# EAGLE schematic xmega-128a4u-switch (EAGLE 8.3.2)
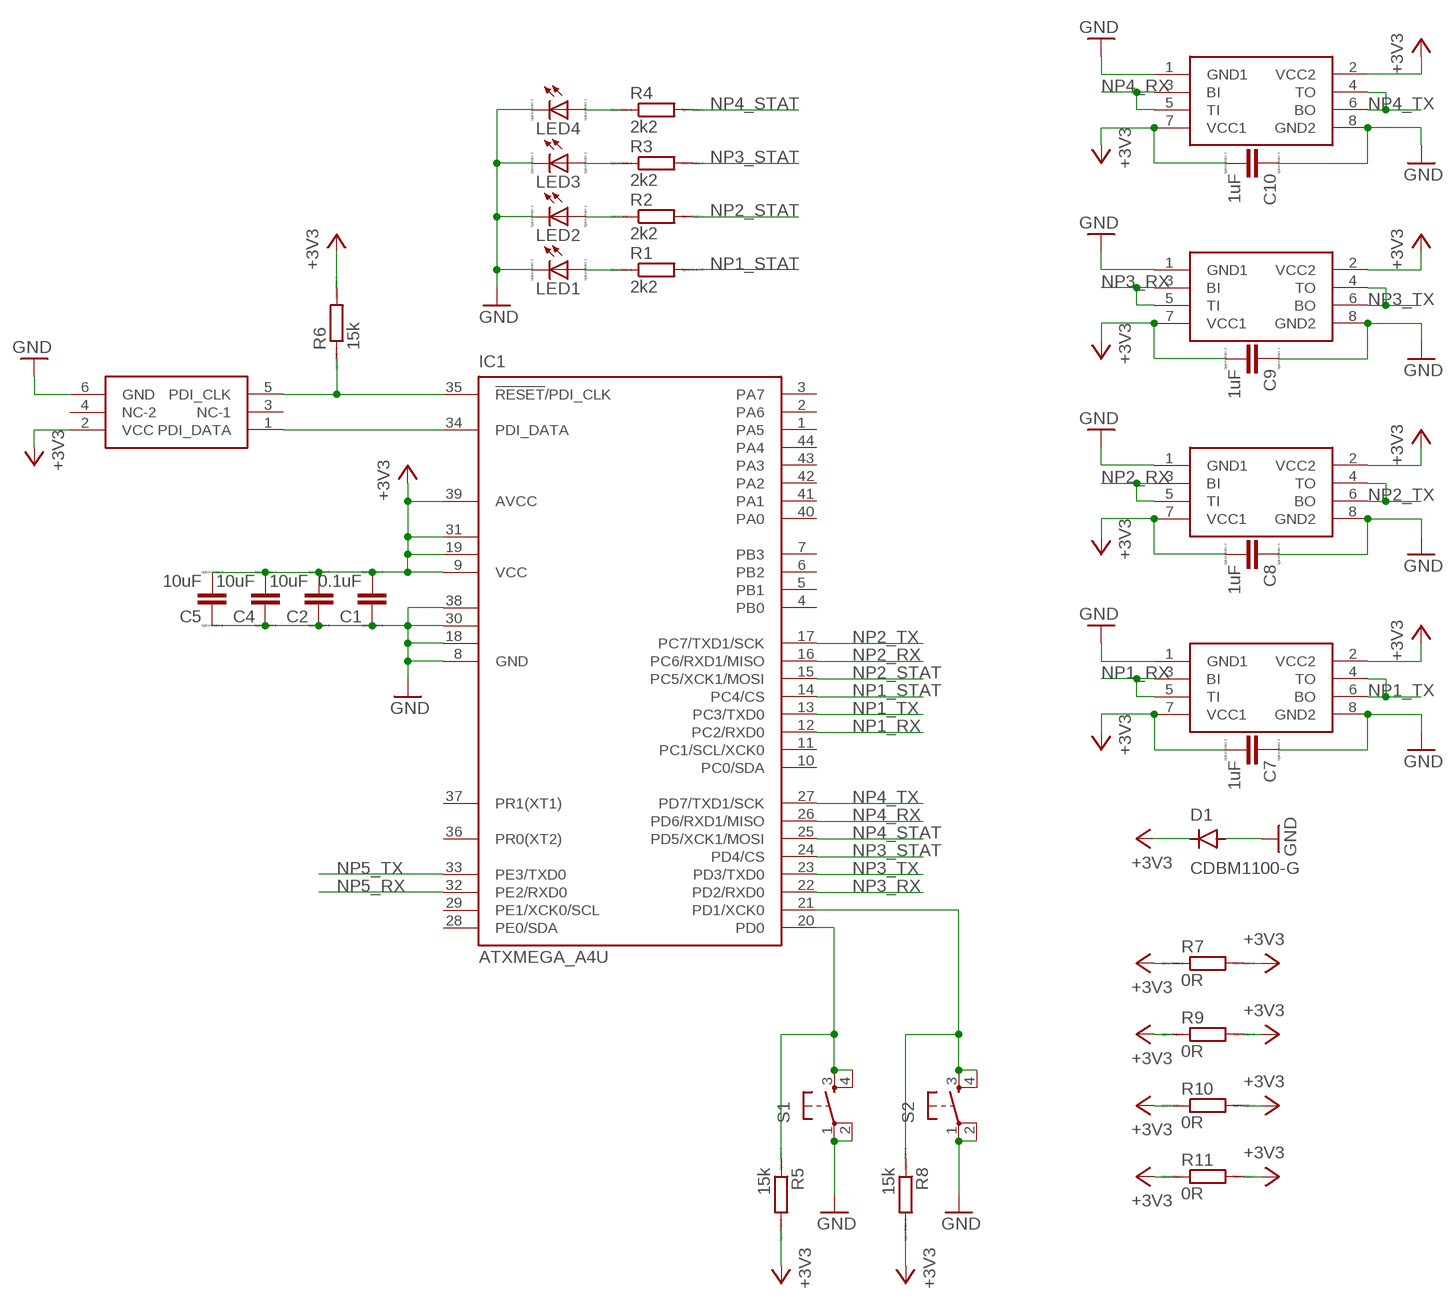
[diagram p0: schematic, sheet 1]

## Parts
C1  0.1uF  C  [C0805]
C2  10uF  CC1206  [C1206]
C4  10uF  CC1206  [C1206]
C5  10uF  CC1206  [C1206]
C7  1uF  C  [C0805]
C8  1uF  C  [C0805]
C9  1uF  C  [C0805]
C10  1uF  C  [C0805]
D1  CDBM1100-G  [MINI-SMA]
IC1  ATXMEGA_A4U  [TQFP44-13THIN]
LED1  LED_E  [LED_1206]
LED2  LED_E  [LED_1206]
LED3  LED_E  [LED_1206]
LED4  LED_E  [LED_1206]
R1  2k2  RR1206  [R1206]
R2  2k2  RR1206  [R1206]
R3  2k2  RR1206  [R1206]
R4  2k2  RR1206  [R1206]
R5  15k  R  [R0805]
R6  15k  R  [R0805]
R7  0R  RR1206  [R1206]
R8  15k  R  [R0805]
R9  0R  RR1206  [R1206]
R10  0R  RR1206  [R1206]
R11  0R  RR1206  [R1206]
S1  6MM_SWITCH6MM_SWITCH  [6MM_SWITCH]
S2  6MM_SWITCH6MM_SWITCH  [6MM_SWITCH]
U$3  NETPORT_IDC_FULLFLIP  [2X04SMD]
U$4  NETPORT_IDC_FULLFLIP  [2X04SMD]
U$5  NETPORT_IDC_FULLFLIP  [2X04SMD]
U$6  NETPORT_IDC_FULLFLIP  [2X04SMD]
U$7  PDI  [2X03SMD]

## Nets
+3V3: C1.2 C2.2 C4.2 C5.2 C7.2 C8.2 C9.2 C10.2 D1.KATHODE IC1.9(VCC) IC1.19(VCC1) IC1.31(VCC2) IC1.39(AVCC) R5.2 R6.2 R7.1 R7.2 R8.2 R9.1 R9.2 R10.1 R10.2 R11.1 R11.2 U$3.2(VCC2) U$3.7(VCC1) U$4.2(VCC2) U$4.7(VCC1) U$5.2(VCC2) U$5.7(VCC1) U$6.2(VCC2) U$6.7(VCC1) U$7.2(VCC)
GND: C1.1 C2.1 C4.1 C5.1 C7.1 C8.1 C9.1 C10.1 D1.ANODE IC1.8(GND) IC1.18(GND1) IC1.30(GND2) IC1.38(GND3) LED1.C LED2.C LED3.C LED4.C S1.1(P) S1.2(P1) S2.1(P) S2.2(P1) U$3.1(GND1) U$3.8(GND2) U$4.1(GND1) U$4.8(GND2) U$5.1(GND1) U$5.8(GND2) U$6.1(GND1) U$6.8(GND2) U$7.6(GND)
N$1: LED4.A R4.1
N$2: LED3.A R3.1
N$3: LED2.A R2.1
N$4: LED1.A R1.1
N$5: IC1.35(!RESET!/PDI_CLK) R6.1 U$7.5(PDI_CLK)
N$6: IC1.34(PDI_DATA) U$7.1(PDI_DATA)
N$7: IC1.20(PD0) R5.1 S1.3(S) S1.4(S1)
N$9: IC1.21(PD1/XCK0) R8.1 S2.3(S) S2.4(S1)
NP1_RX: IC1.12(PC2/RXD0) U$3.3(BI) U$3.5(TI)
NP1_STAT: IC1.14(PC4/CS) R1.2
NP1_TX: IC1.13(PC3/TXD0) U$3.4(TO) U$3.6(BO)
NP2_RX: IC1.16(PC6/RXD1/MISO) U$4.3(BI) U$4.5(TI)
NP2_STAT: IC1.15(PC5/XCK1/MOSI) R2.2
NP2_TX: IC1.17(PC7/TXD1/SCK) U$4.4(TO) U$4.6(BO)
NP3_RX: IC1.22(PD2/RXD0) U$5.3(BI) U$5.5(TI)
NP3_STAT: IC1.24(PD4/CS) R3.2
NP3_TX: IC1.23(PD3/TXD0) U$5.4(TO) U$5.6(BO)
NP4_RX: IC1.26(PD6/RXD1/MISO) U$6.3(BI) U$6.5(TI)
NP4_STAT: IC1.25(PD5/XCK1/MOSI) R4.2
NP4_TX: IC1.27(PD7/TXD1/SCK) U$6.4(TO) U$6.6(BO)
NP5_RX: IC1.32(PE2/RXD0)
NP5_TX: IC1.33(PE3/TXD0)
Unconnected: IC1.1(PA5) IC1.2(PA6) IC1.3(PA7) IC1.4(PB0) IC1.5(PB1) IC1.6(PB2) IC1.7(PB3) IC1.10(PC0/SDA) IC1.11(PC1/SCL/XCK0) IC1.28(PE0/SDA) IC1.29(PE1/XCK0/SCL) IC1.36(PR0(XT2)) IC1.37(PR1(XT1)) IC1.40(PA0) IC1.41(PA1) IC1.42(PA2) IC1.43(PA3) IC1.44(PA4) U$7.3(NC-1) U$7.4(NC-2)

## Library data of the parts
C1 C2 C4 C5 C7-C10 = eagle-ltspice:C: CAPACITOR, European symbol; SPICEMODEL: NONE; SPICEPREFIX: C
D1 = fab:CDBM1100-G: Diode schottky 100V 1A mini-SMA as found in the fablab inventory Reverse Voltage: 100 Volts Forward Current: 1.0 Amp Maximum forward voltage: 0.85 Volts Made by Zaerc.
IC1 = fab:ATXMEGA_A4U
LED1-LED4 = eagle-ltspice:LED_E: LED Source: http://www.osram.convergy.de Source: www.luxeon.com Source: www.kingbright.com; SPICEMODEL: NONE; SPICEPREFIX: D; SPICETYPE: diode
R1-R11 = eagle-ltspice:R: RESISTOR, European symbol; SPICEMODEL: NONE; SPICEPREFIX: R
S1 S2 = fab:6MM_SWITCH: OMRON SWITCH
U$3-U$6 = fab:NETPORT_IDC_FULLFLIP
U$7 = fab:PDI